# Altium schematic sheet Sheet1.SchDoc
size A
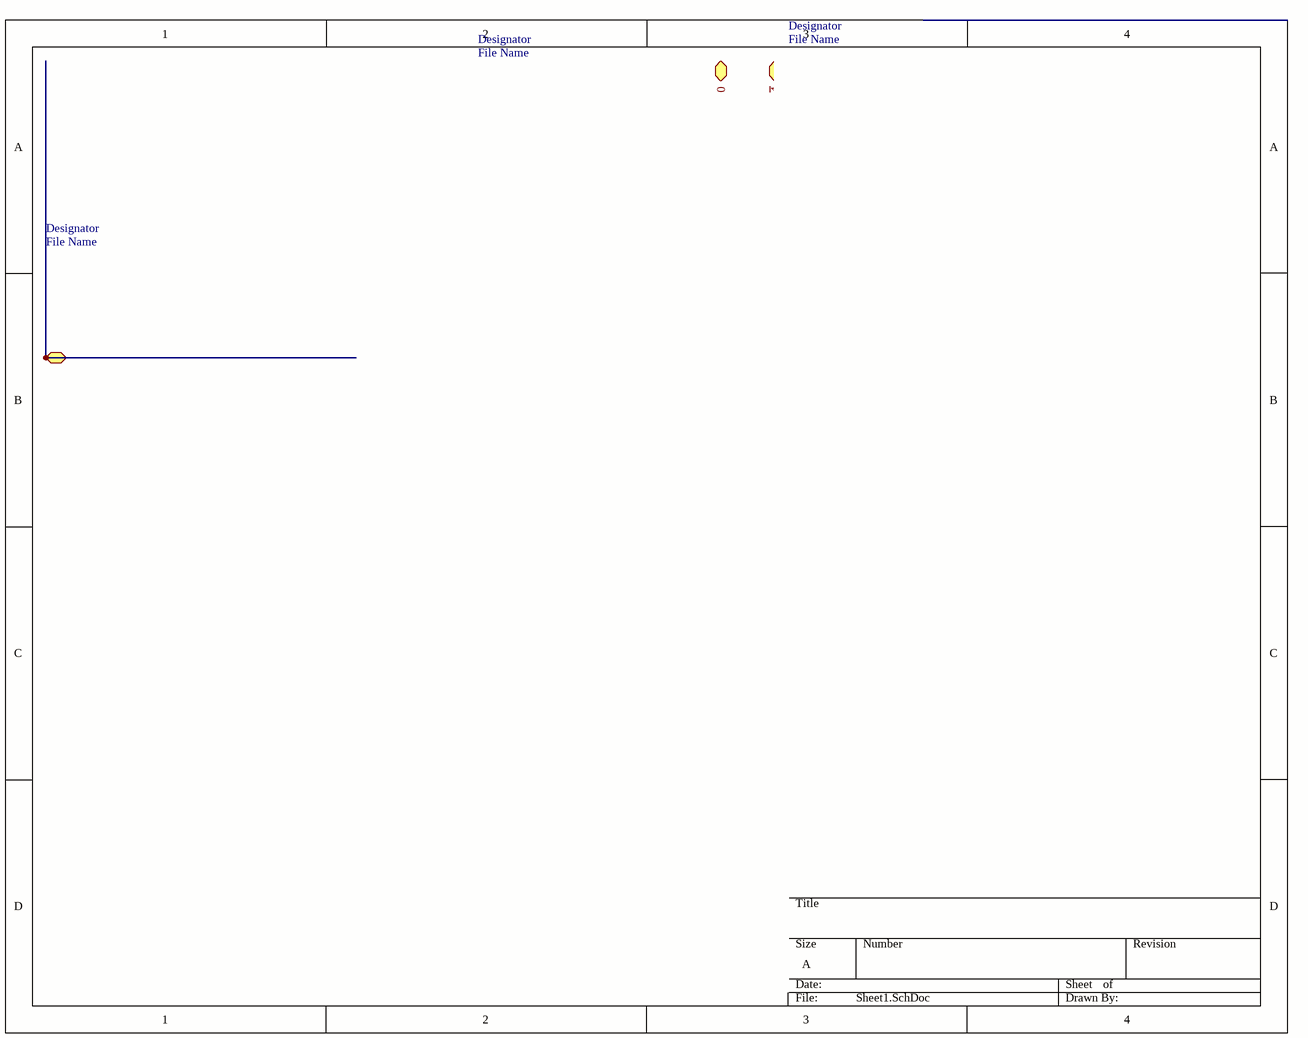
[diagram p0: Sheet1.SchDoc]

## Sub-sheets
Designator = File Name: no entries
Designator = File Name: 0, ~{4},  (bidir)
Designator = File Name: no entries